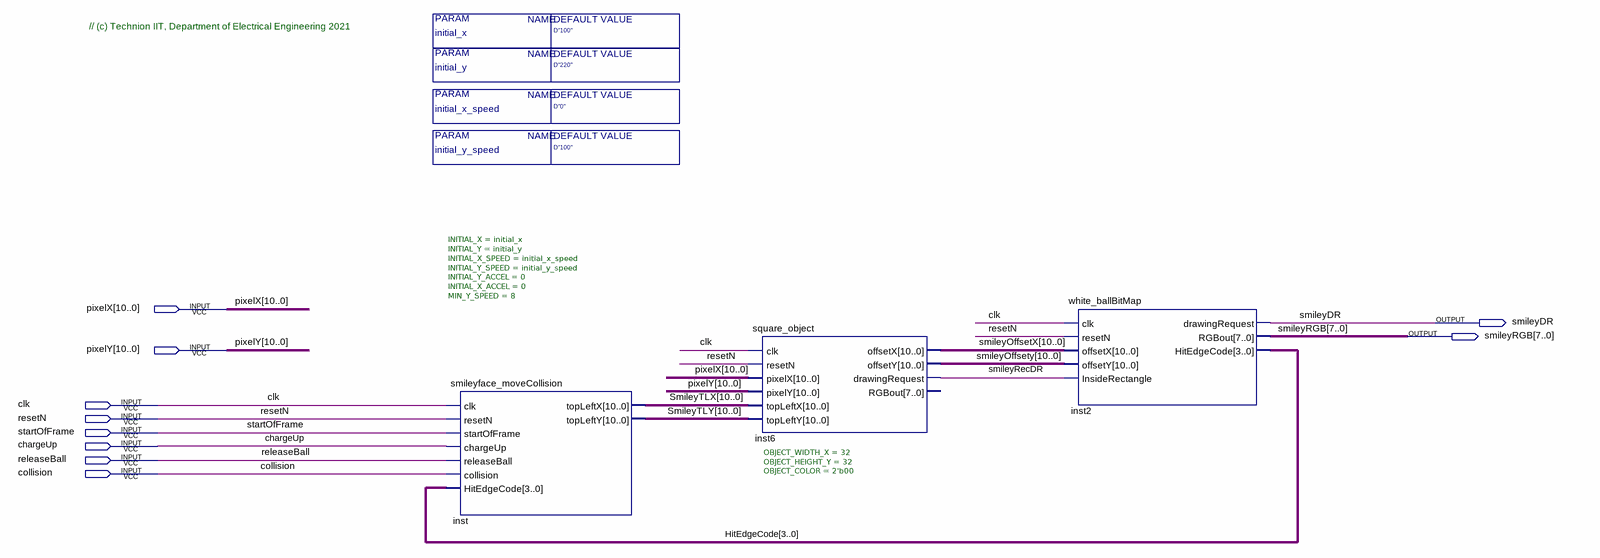
[diagram p0: schematic sheet]
// Quartus schematic Smiley_Block.bdf as structural Verilog: 3 symbols, 10 pins
module Smiley_Block #(parameter initial_x = "D\"100\"", parameter initial_y = "D\"220\"", parameter initial_x_speed = "D\"0\"", parameter initial_y_speed = "D\"100\"") (
  input  [10:0] pixelX,
  input  [10:0] pixelY,
  input  clk,
  input  resetN,
  input  startOfFrame,
  input  chargeUp,
  input  releaseBall,
  input  collision,
  output smileyDR,
  output [7:0] smileyRGB
);

  wire smileyRecDR;
  wire [3:0] HitEdgeCode;
  wire [10:0] smileyOffsetX, smileyOffsety, SmileyTLX, SmileyTLY;

  smileyface_moveCollision #(.INITIAL_X(initial_x), .INITIAL_Y(initial_y), .INITIAL_X_SPEED(initial_x_speed), .INITIAL_Y_SPEED(initial_y_speed), .INITIAL_Y_ACCEL(0), .INITIAL_X_ACCEL(0), .MIN_Y_SPEED(8)) inst (
    .clk(clk), .resetN(resetN), .startOfFrame(startOfFrame), .chargeUp(chargeUp), .releaseBall(releaseBall),
    .collision(collision), .HitEdgeCode(HitEdgeCode), .topLeftX(SmileyTLX), .topLeftY(SmileyTLY));
  square_object #(.OBJECT_WIDTH_X(32), .OBJECT_HEIGHT_Y(32), .OBJECT_COLOR(2'b00)) inst6 (
    .clk(clk), .resetN(resetN), .pixelX(pixelX), .pixelY(pixelY), .topLeftX(SmileyTLX), .topLeftY(SmileyTLY),
    .offsetX(smileyOffsetX), .offsetY(smileyOffsety), .drawingRequest(smileyRecDR));  // open: RGBout
  white_ballBitMap inst2 (
    .clk(clk), .resetN(resetN), .offsetX(smileyOffsetX), .offsetY(smileyOffsety),
    .InsideRectangle(smileyRecDR), .drawingRequest(smileyDR), .RGBout(smileyRGB), .HitEdgeCode(HitEdgeCode));

  // Notes on the sheet:
  //   // (c) Technion IIT, Department of Electrical Engineering 2021
endmodule
